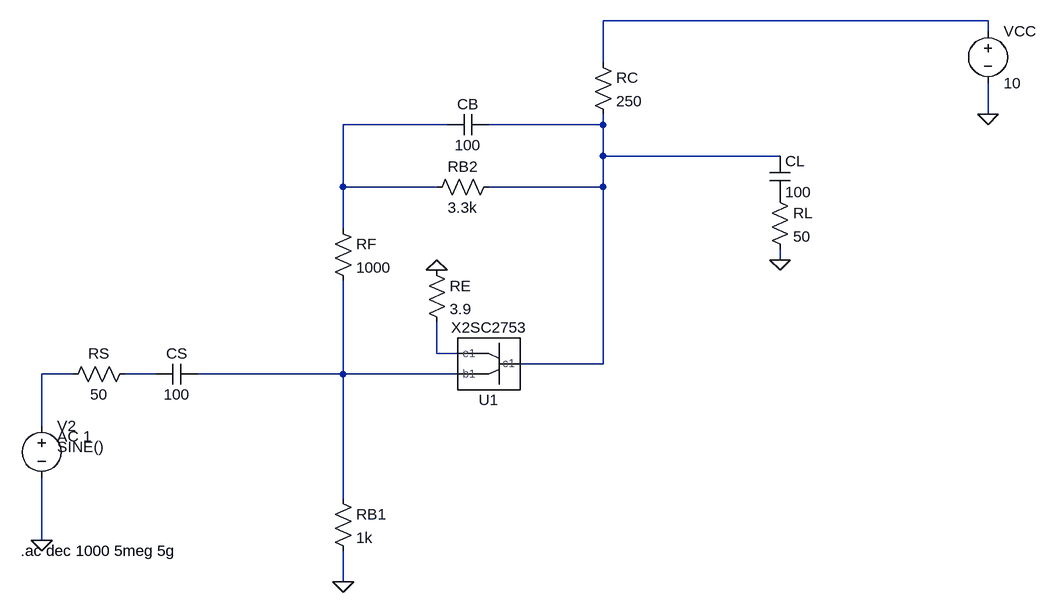
[diagram p0: schematic broadband.asc]
broadband.asc, the LTspice schematic file:
Version 4
SHEET 1 944 680
WIRE 784 -464 192 -464
WIRE 784 -448 784 -464
WIRE 192 -400 192 -464
WIRE 784 -320 784 -368
WIRE -48 -304 -208 -304
WIRE 192 -304 192 -320
WIRE 192 -304 16 -304
WIRE 192 -256 192 -304
WIRE 464 -256 192 -256
WIRE -208 -208 -208 -304
WIRE -64 -208 -208 -208
WIRE 192 -208 192 -256
WIRE 192 -208 16 -208
WIRE -208 -144 -208 -208
WIRE 464 -96 464 -112
WIRE -64 48 -64 0
WIRE -32 48 -64 48
WIRE 192 64 192 -208
WIRE 192 64 64 64
WIRE -624 80 -672 80
WIRE -496 80 -544 80
WIRE -208 80 -208 -64
WIRE -208 80 -432 80
WIRE -32 80 -208 80
WIRE -672 160 -672 80
WIRE -208 272 -208 80
WIRE -672 336 -672 240
WIRE -208 400 -208 352
FLAG 784 -320 0
FLAG -672 336 0
FLAG 464 -96 0
FLAG -208 400 0
FLAG -64 -80 0
SYMBOL res 176 -416 R0
SYMATTR InstName RC
SYMATTR Value 250
SYMBOL voltage 784 -464 R0
WINDOW 123 0 0 Left 0
WINDOW 39 0 0 Left 0
SYMATTR InstName VCC
SYMATTR Value 10
SYMBOL voltage -672 144 R0
WINDOW 123 24 32 Left 2
WINDOW 39 24 64 Left 2
WINDOW 3 24 48 Left 2
SYMATTR Value2 AC 1
SYMATTR Value SINE()
SYMATTR InstName V2
SYMBOL cap -432 64 R90
WINDOW 0 0 32 VBottom 2
WINDOW 3 32 32 VTop 2
SYMATTR InstName CS
SYMATTR Value 100
SYMBOL res -224 -160 R0
SYMATTR InstName RF
SYMATTR Value 1000
SYMBOL res -224 256 R0
SYMATTR InstName RB1
SYMATTR Value 1k
SYMBOL X2SC2753 16 64 R180
SYMATTR InstName U1
SYMBOL res -528 64 R90
WINDOW 0 0 56 VBottom 2
WINDOW 3 32 56 VTop 2
SYMATTR InstName RS
SYMATTR Value 50
SYMBOL res -80 -96 R0
SYMATTR InstName RE
SYMATTR Value 3.9
SYMBOL res 448 -208 R0
SYMATTR InstName RL
SYMATTR Value 50
SYMBOL res 32 -224 R90
WINDOW 0 0 56 VBottom 2
WINDOW 3 32 56 VTop 2
SYMATTR InstName RB2
SYMATTR Value 3.3k
SYMBOL cap 16 -320 R90
WINDOW 0 0 32 VBottom 2
WINDOW 3 32 32 VTop 2
SYMATTR InstName CB
SYMATTR Value 100
SYMBOL cap 448 -256 R0
SYMATTR InstName CL
SYMATTR Value 100
TEXT -704 352 Left 2 !.ac dec 1000 5meg 5g

The netlist it stands for:
* broadband.asc
RC N001 N003 250
VCC N001 0 10
V2 N005 0 SINE() AC 1
CS N007 N006 100
RF N002 N007 1000
RB1 N007 0 1k
XU1 N003 N007 N004 X2SC2753  ; pins c1 b1 e1
RS N006 N005 50
RE 0 N004 3.9
RL P001 0 50
RB2 N003 N002 3.3k
CB N003 N002 100
CL N003 P001 100
.ac dec 1000 5meg 5g
.lib C:/Users/jonathansharir-smith/Desktop/251SPICE/Lab2/narrowband\2SC2753.lib
.backanno
.end